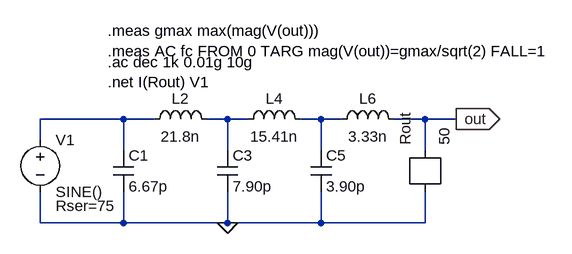
[diagram p0: schematic Microfita.asc]
Microfita.asc, the LTspice schematic file:
Version 4
SHEET 1 880 680
WIRE 208 304 80 304
WIRE 256 304 208 304
WIRE 368 304 336 304
WIRE 400 304 368 304
WIRE 512 304 480 304
WIRE 544 304 512 304
WIRE 672 304 624 304
WIRE 720 304 672 304
WIRE 80 336 80 304
WIRE 208 352 208 304
WIRE 368 352 368 304
WIRE 512 352 512 304
WIRE 672 352 672 304
WIRE 80 464 80 416
WIRE 208 464 208 416
WIRE 208 464 80 464
WIRE 368 464 368 416
WIRE 368 464 208 464
WIRE 512 464 512 416
WIRE 512 464 368 464
WIRE 672 464 672 416
WIRE 672 464 512 464
FLAG 368 464 0
FLAG 720 304 out
IOPIN 720 304 Out
SYMBOL ind 240 320 R270
WINDOW 0 32 56 VTop 2
WINDOW 3 5 56 VBottom 2
SYMATTR InstName L2
SYMATTR Value 21.8n
SYMBOL ind 384 320 R270
WINDOW 0 32 56 VTop 2
WINDOW 3 5 56 VBottom 2
SYMATTR InstName L4
SYMATTR Value 15.41n
SYMBOL ind 528 320 R270
WINDOW 0 32 56 VTop 2
WINDOW 3 5 56 VBottom 2
SYMATTR InstName L6
SYMATTR Value 3.33n
SYMBOL cap 192 352 R0
SYMATTR InstName C1
SYMATTR Value 6.67p
SYMBOL cap 352 352 R0
SYMATTR InstName C3
SYMATTR Value 7.90p
SYMBOL cap 496 352 R0
SYMATTR InstName C5
SYMATTR Value 3.90p
SYMBOL voltage 80 320 R0
WINDOW 39 24 118 Left 2
SYMATTR SpiceLine Rser=75
SYMATTR InstName V1
SYMATTR Value SINE()
SYMATTR Value2 AC 1
SYMBOL r 672 416 R270
SYMATTR InstName Rout
SYMATTR Value 50
TEXT 184 216 Left 2 !.ac dec 1k 0.01g 10g\n.net I(Rout) V1
TEXT 184 168 Left 2 !.meas gmax max(mag(V(out)))\n.meas AC fc FROM 0 TARG mag(V(out))=gmax/sqrt(2) FALL=1

The netlist it stands for:
* Microfita.asc
L2 N001 N002 21.8n
L4 N002 N003 15.41n
L6 N003 out 3.33n
C1 N001 0 6.67p
C3 N002 0 7.90p
C5 N003 0 3.90p
V1 N001 0 SINE() AC 1 Rser=75
Rout out 0 50
.ac dec 1k 0.01g 10g
.net I(Rout) V1
.meas gmax max(mag(V(out)))
.meas AC fc FROM 0 TARG mag(V(out))=gmax/sqrt(2) FALL=1
.backanno
.end